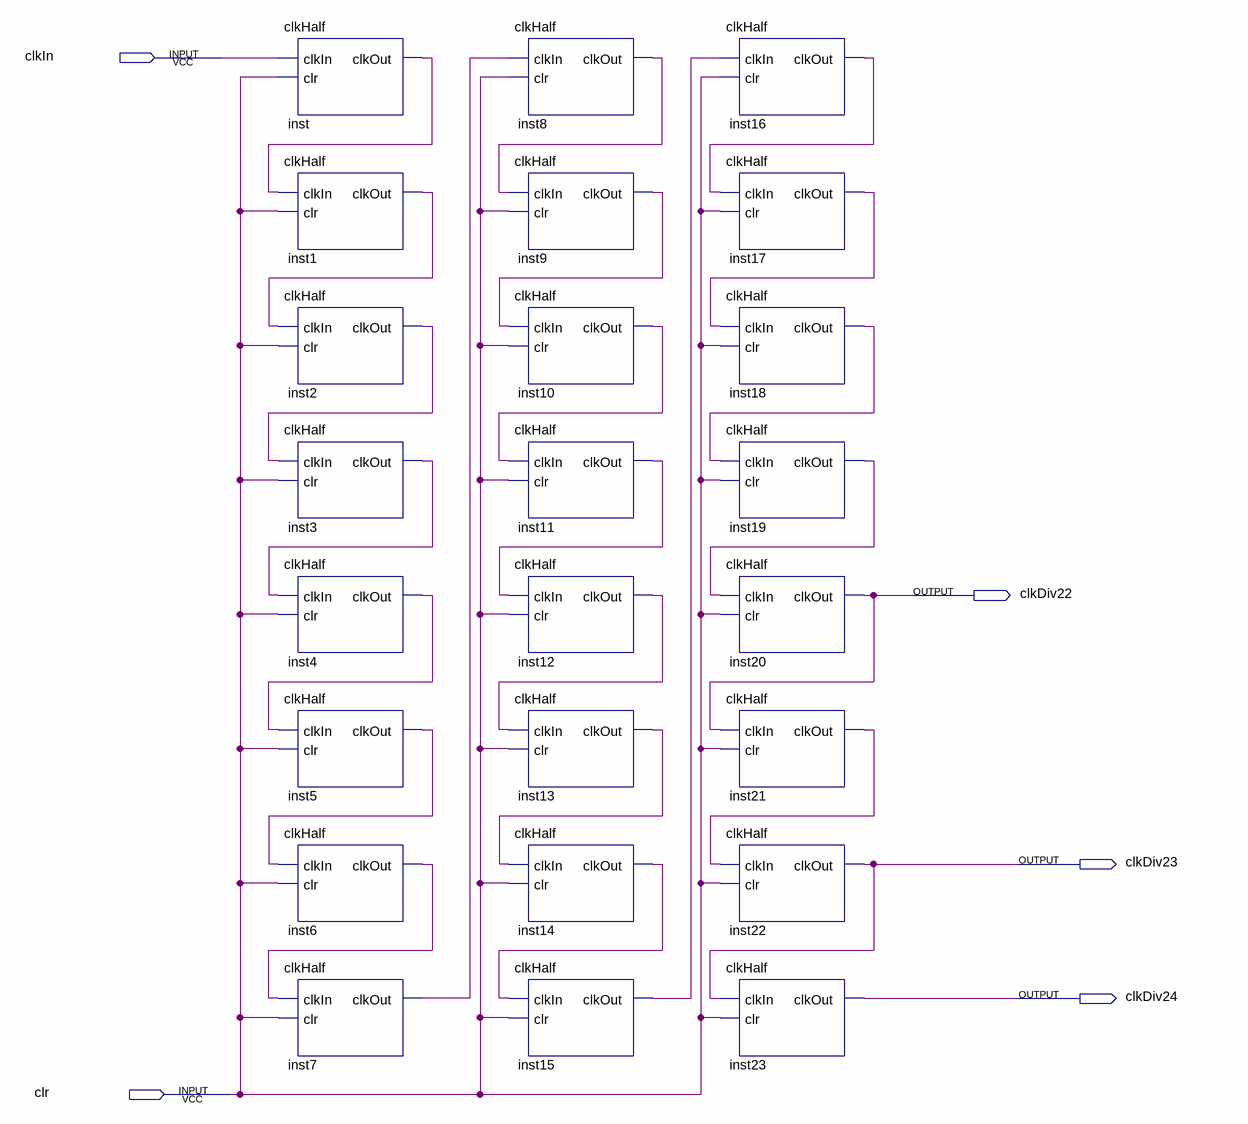
[diagram p0: schematic sheet]
// Quartus schematic clkDivider.bdf as structural Verilog: 24 symbols, 5 pins
module clkDivider (
  input  clkIn,
  input  clr,
  output clkDiv22,
  output clkDiv23,
  output clkDiv24
);

  wire inst1_clkout, inst2_clkout, inst3_clkout, inst4_clkout, inst5_clkout, inst6_clkout, inst7_clkout,
       inst8_clkout, inst9_clkout, inst10_clkout, inst11_clkout, inst12_clkout, inst13_clkout, inst14_clkout,
       inst15_clkout, inst16_clkout, inst17_clkout, inst18_clkout, inst19_clkout, inst21_clkout, inst_clkout;

  clkHalf inst (.clkIn(clkIn), .clr(clr), .clkOut(inst_clkout));
  clkHalf inst1 (.clkIn(inst_clkout), .clr(clr), .clkOut(inst1_clkout));
  clkHalf inst2 (.clkIn(inst1_clkout), .clr(clr), .clkOut(inst2_clkout));
  clkHalf inst3 (.clkIn(inst2_clkout), .clr(clr), .clkOut(inst3_clkout));
  clkHalf inst4 (.clkIn(inst3_clkout), .clr(clr), .clkOut(inst4_clkout));
  clkHalf inst5 (.clkIn(inst4_clkout), .clr(clr), .clkOut(inst5_clkout));
  clkHalf inst6 (.clkIn(inst5_clkout), .clr(clr), .clkOut(inst6_clkout));
  clkHalf inst7 (.clkIn(inst6_clkout), .clr(clr), .clkOut(inst7_clkout));
  clkHalf inst8 (.clkIn(inst7_clkout), .clr(clr), .clkOut(inst8_clkout));
  clkHalf inst9 (.clkIn(inst8_clkout), .clr(clr), .clkOut(inst9_clkout));
  clkHalf inst10 (.clkIn(inst9_clkout), .clr(clr), .clkOut(inst10_clkout));
  clkHalf inst11 (.clkIn(inst10_clkout), .clr(clr), .clkOut(inst11_clkout));
  clkHalf inst12 (.clkIn(inst11_clkout), .clr(clr), .clkOut(inst12_clkout));
  clkHalf inst13 (.clkIn(inst12_clkout), .clr(clr), .clkOut(inst13_clkout));
  clkHalf inst14 (.clkIn(inst13_clkout), .clr(clr), .clkOut(inst14_clkout));
  clkHalf inst15 (.clkIn(inst14_clkout), .clr(clr), .clkOut(inst15_clkout));
  clkHalf inst16 (.clkIn(inst15_clkout), .clr(clr), .clkOut(inst16_clkout));
  clkHalf inst17 (.clkIn(inst16_clkout), .clr(clr), .clkOut(inst17_clkout));
  clkHalf inst18 (.clkIn(inst17_clkout), .clr(clr), .clkOut(inst18_clkout));
  clkHalf inst19 (.clkIn(inst18_clkout), .clr(clr), .clkOut(inst19_clkout));
  clkHalf inst20 (.clkIn(inst19_clkout), .clr(clr), .clkOut(clkDiv22));
  clkHalf inst21 (.clkIn(clkDiv22), .clr(clr), .clkOut(inst21_clkout));
  clkHalf inst22 (.clkIn(inst21_clkout), .clr(clr), .clkOut(clkDiv23));
  clkHalf inst23 (.clkIn(clkDiv23), .clr(clr), .clkOut(clkDiv24));
endmodule
